# EAGLE design led_nightlight (EAGLE 6.1)
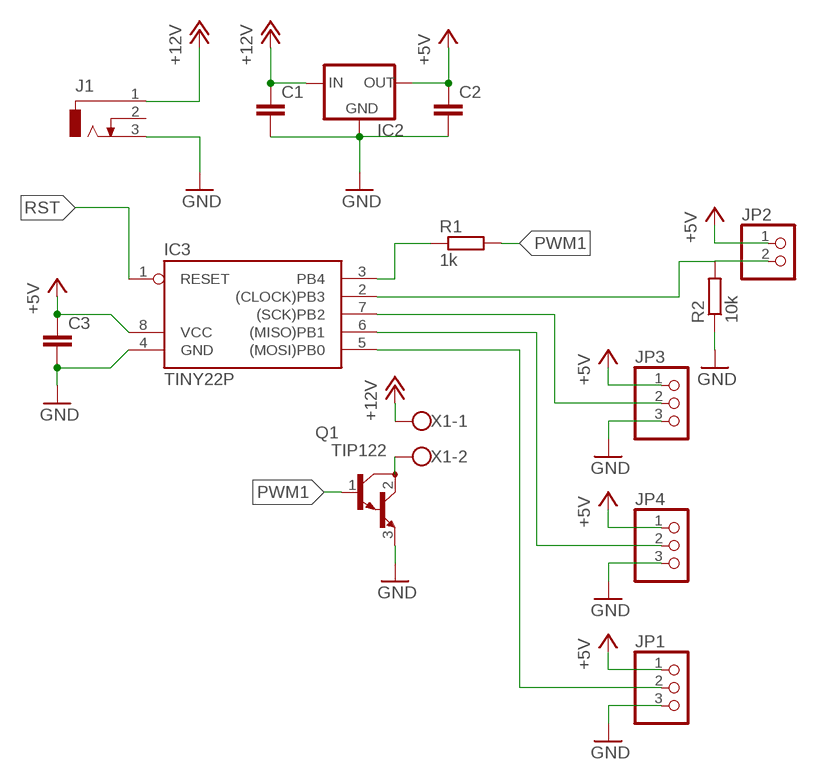
[diagram p0: schematic, sheet 1]

## Parts
C1  C-EU025-024X044  [C025-024X044]
C2  C-EU025-024X044  [C025-024X044]
C3  C-EU025-024X044  [C025-024X044]
IC2  78XXL  [78XXL]
IC3  TINY22P  [DIL08]
J1  DCJ0303  [DCJ0303]
JP1  PINHD-1X3  [1X03]
JP2  PINHD-1X2  [1X02]
JP3  PINHD-1X3  [1X03]
JP4  PINHD-1X3  [1X03]
Q1  TIP122  [TO220]
R1  1k  R-EU_0207/10  [0207/10]
R2  10k  R-EU_0207/10  [0207/10]
X1  W237-102  [W237-102]

## Nets
+5V: C2.1 C3.1 IC2.OUT IC3.8(VCC) JP1.1 JP2.1 JP3.1 JP4.1
+12V: C1.1 IC2.IN J1.1 X1.1
GND: C1.2 C2.2 C3.2 IC2.GND IC3.4(GND) J1.3 JP1.3 JP3.3 JP4.3 Q1.3(E) R2.1
MISO: IC3.6((MISO)PB1) JP4.2
MOSI: IC3.5((MOSI)PB0) JP1.2
N$1: Q1.2(C) X1.2
N$2: IC3.3(PB4) R1.1
N$3: IC3.2((CLOCK)PB3) JP2.2 R2.2
PWM1: Q1.1(B) R1.2
RST: IC3.1(RESET)
SCK: IC3.7((SCK)PB2) JP3.2
Unconnected: J1.2

## Library data of the parts
C1-C3 = resistor:C-EU: CAPACITOR, European symbol
IC2 = v-reg:78XXL: VOLTAGE REGULATOR
IC3 = avr-7:TINY22: MICROCONTROLLER 1K ROM 128 bytes RAM 128 bytes EEPROM
J1 = con-jack:DCJ0303: DC POWER JACK Source: DCJ0303.pdf; OC_FARNELL: unknown; OC_NEWARK: unknown
JP1 JP3 JP4 = pinhead:PINHD-1X3: PIN HEADER
JP2 = pinhead:PINHD-1X2: PIN HEADER
Q1 = transistor-npn:TIP122*: NPN Darlington Transistor
R1 R2 = resistor:R-EU_: RESISTOR, European symbol
X1 = con-wago-500:W237-102: WAGO SCREW CLAMP; MPN: 237-102; OC_FARNELL: unknown; OC_NEWARK: 70K9898

## Board
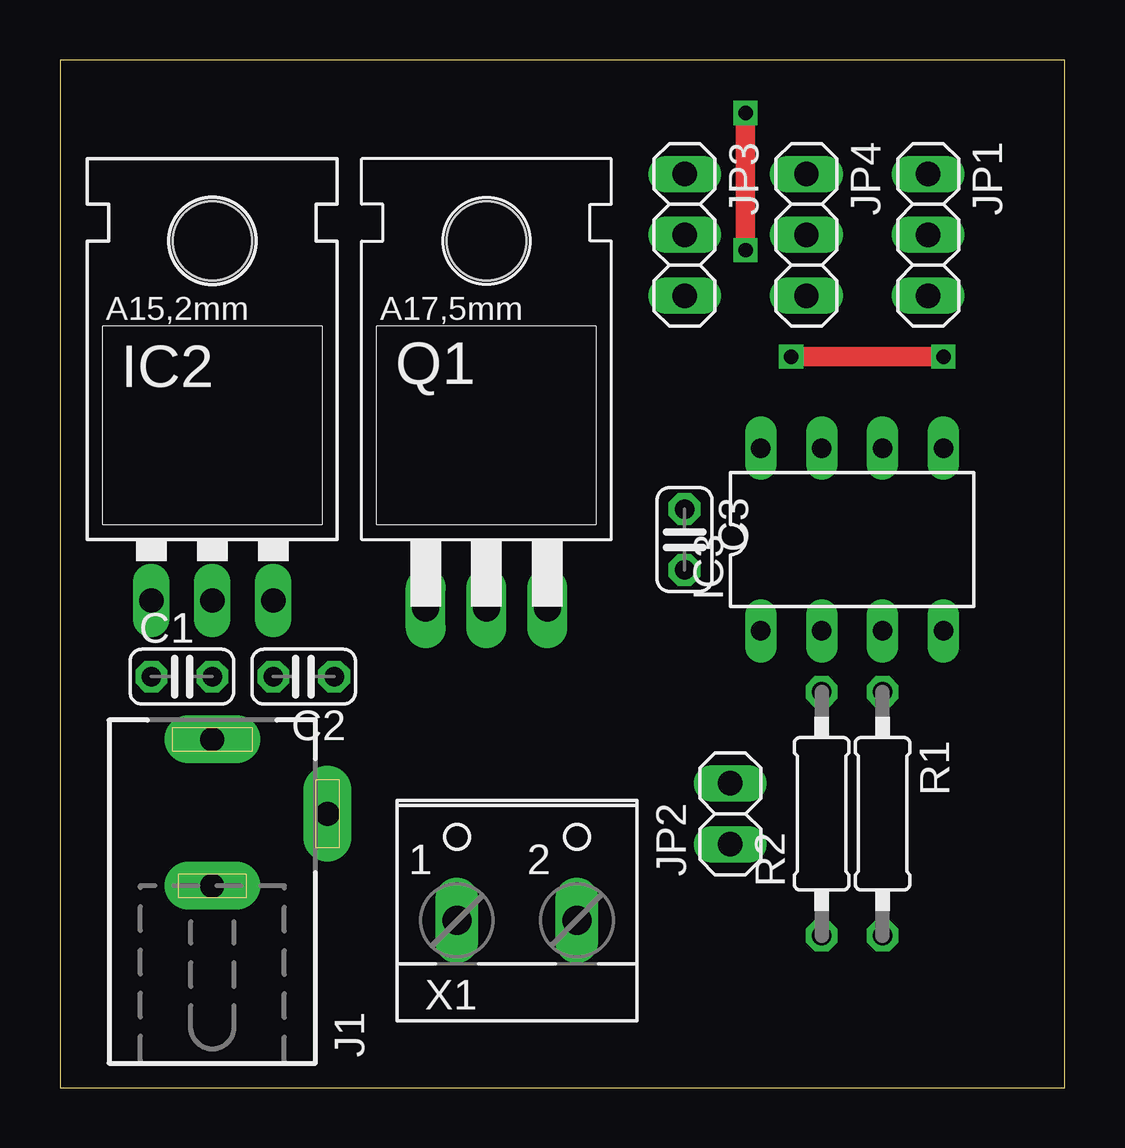
[diagram p1: board, top side]
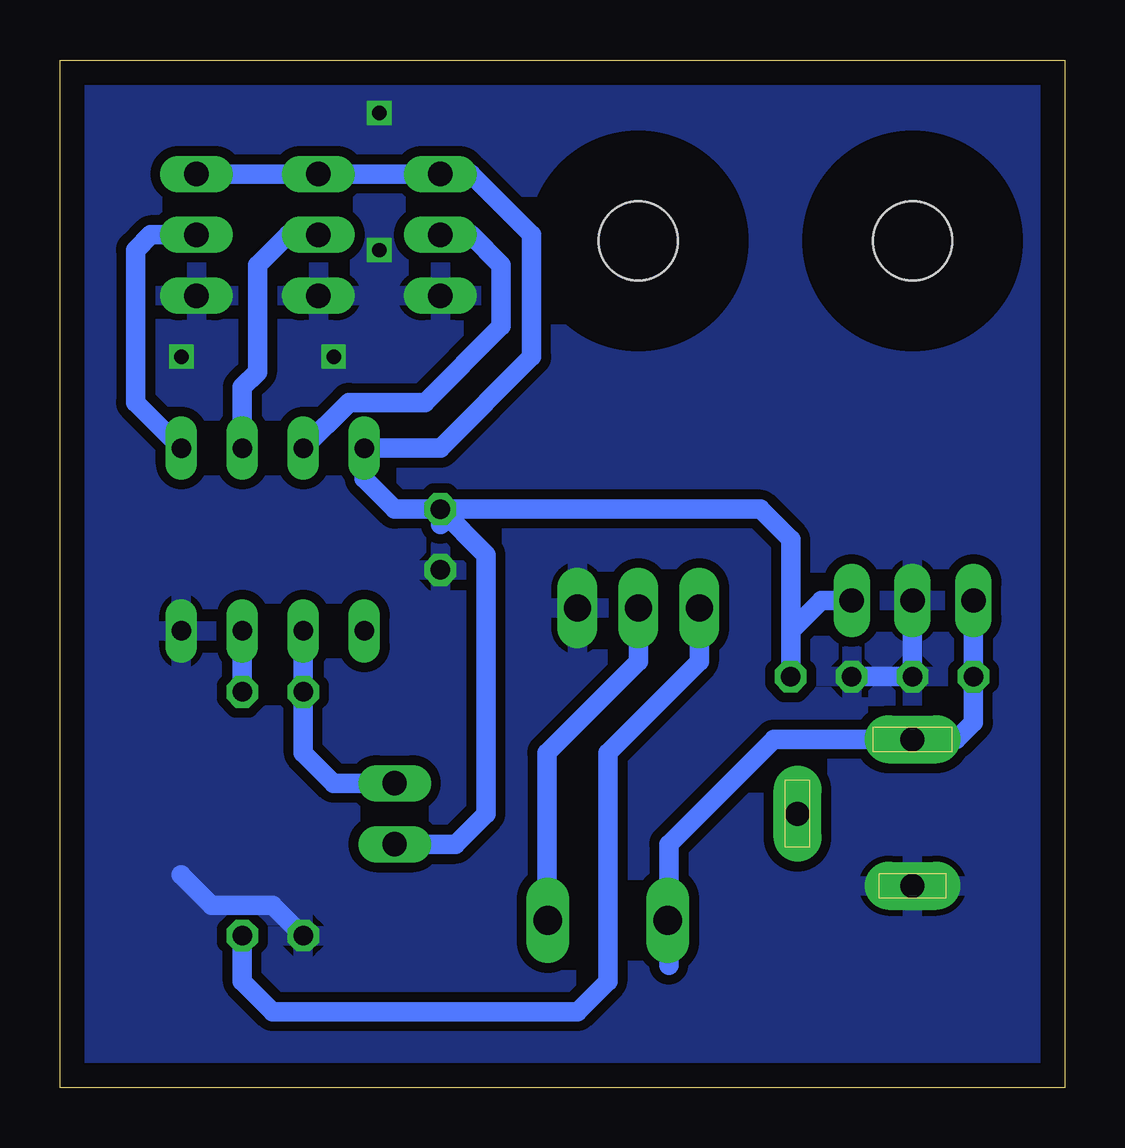
[diagram p2: board, bottom side, seen from below]

Size 41.89 x 42.85 mm. Coordinates in mm from the lower left corner, seen from the top.
Outline: 0,0 41.89,0 41.89,42.85 0,42.85 0,0
Copper layers (1*16): Top 0.035mm / dielectric 1.5mm / Bottom 0.035mm
Design rules: minimum track width 10mil, minimum drill 24mil, track to track 8mil, track to pad 8mil, pad to pad 8mil, via to via 8mil, smd to smd 8mil, copper to edge 40mil, drill to drill 8mil, minimum pad ring 10mil, minimum via ring 8mil, stop-mask expansion 4mil, vias tented up to drill 0mil, thermal gap 10mil

### Footprints (pad centres in the part's own frame; a part is rotated, then mirrored left to right if it is on the bottom)
C025-024X044 = drill 0.813 octagon: 1 -1.27,0; 2 1.27,0
78XXL = drill 1.016 long: GND 0,-3.81; IN -2.54,-3.81; OUT 2.54,-3.81 | hole 3.302: 0,11.176
DIL08 = drill 0.813 long: 1 -3.81,-3.81; 2 -1.27,-3.81; 3 1.27,-3.81; 4 3.81,-3.81; 5 3.81,3.81; 6 1.27,3.81; 7 -1.27,3.81; 8 -3.81,3.81
DCJ0303 = drill 1 pad 2 long: 1 0,3.1; 2 4.8,0; 3 0,-3
1X03 = drill 1.016 long: 1 -2.54,0; 2 0,0; 3 2.54,0
1X02 = drill 1.016 long: 1 -1.27,0; 2 1.27,0
TO220 = drill 1.118 long: 1 -2.54,-4.128; 2 0,-4.128; 3 2.54,-4.128 | hole 3.302: 0,11.176
0207/10 = drill 0.813 octagon: 1 -5.08,0; 2 5.08,0
W237-102 = drill 1.194 long: 1 -2.5,-1.27; 2 2.5,-1.27

### Placement (x,y rotation side)
C1  5.08,17.14 0 top
C2  10.16,17.14 180 top
C3  26.04,22.86 270 top
IC2  6.35,24.13 0 top
IC3  33.02,22.86 0 top
J1  6.35,11.43 0 top
JP1  36.2,35.56 270 top
JP2  27.94,11.43 90 top
JP3  26.04,35.56 270 top
JP4  31.11,35.56 270 top
Q1  17.78,24.13 0 top
R1  34.29,11.43 270 top
R2  31.75,11.43 90 top
X1  19.05,8.26 0 top

### Tracks (layer width: path | path; a pad name or v marks a point on that pad's centre or on a via)
+5V
  Bottom 0.813: C2.1 11.43,19.05 | 11.43,19.05 10.16,20.32 IC2.OUT | JP2.1 25.4,10.16 24.13,11.43 24.13,22.23 C3.1 | C3.1 27.94,24.13 29.21,25.4 IC3.8 26.04,26.67 22.23,30.48 22.23,35.56 24.77,38.1 JP3.1 JP4.1 JP1.1 36.83,38.1 | 11.43,19.05 11.43,22.86 12.7,24.13 25.4,24.13 26.04,23.5 C3.1
+12V
  Bottom 0.813: IC2.IN C1.1 3.81,15.24 4.52,14.53 J1.1 12.14,14.53 16.51,10.16 16.51,5.12 X1.1
GND  (via drill 0.6)
  Top 0.813: v28.57,40.64 v28.57,34.92 | v30.48,30.48 v36.83,30.48
  Bottom 0.813: IC2.GND C1.2 C2.2 | R2.1 33.02,7.62 35.56,7.62 36.83,8.89
  pour Bottom (isolate 0.406): -3.81,45.72 44.45,45.72 44.45,-2.54 -3.81,-2.54
MISO
  Bottom 0.813: JP4.2 32.38,35.56 33.66,34.29 33.66,29.84 34.29,29.21 IC3.6
MOSI
  Bottom 0.813: JP1.2 38.1,35.56 38.73,34.92 38.73,28.57 IC3.5
N$1
  Bottom 0.813: X1.2 21.55,7.66 21.59,7.7 21.59,13.97 17.78,17.78 Q1.2
N$2
  Bottom 0.813: IC3.3 R1.1
N$3
  Bottom 0.813: JP2.2 30.48,12.7 31.75,13.97 R2.2 IC3.2
PWM1
  Bottom 0.813: Q1.1 15.24,17.78 19.05,13.97 19.05,4.45 20.32,3.17 33.02,3.17 34.29,4.45 R1.2
SCK
  Bottom 0.813: IC3.7 29.84,28.57 26.67,28.57 23.5,31.75 23.5,34.29 24.77,35.56 JP3.2